# Altium project stm32h743.PrjPcb
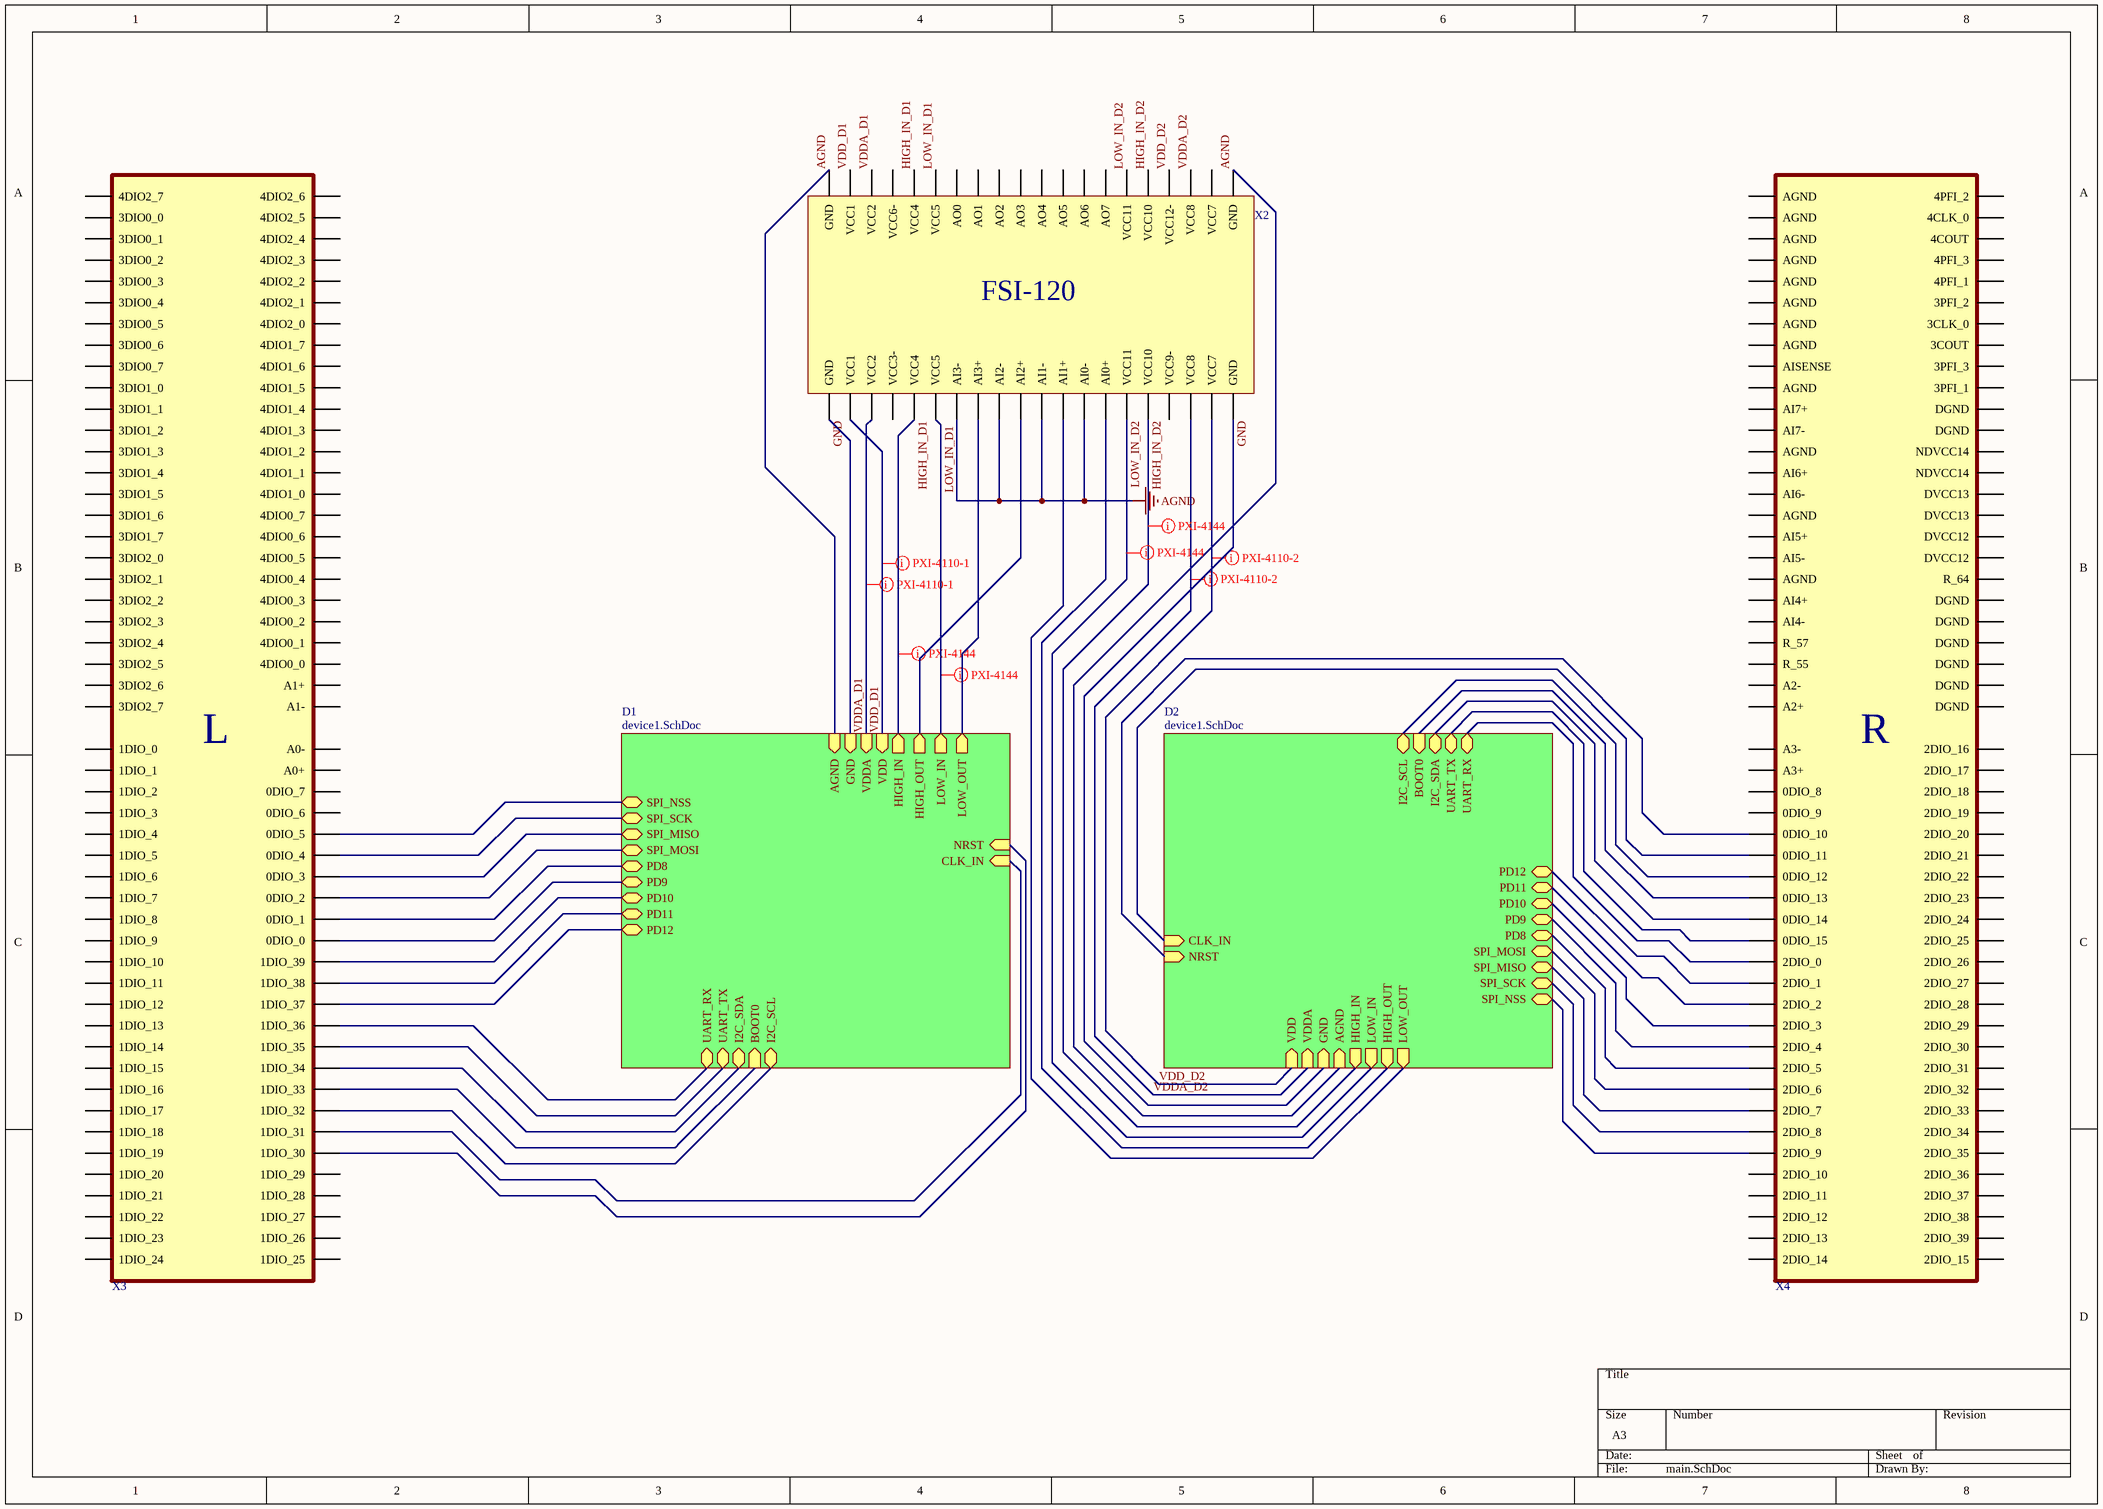
[diagram p0: main.SchDoc]
2 sheets, 37 parts. Net scope: hierarchical (ports join the sheet entries above them; power ports are global).
Board file: board.PcbDoc
Sheets:
  main.SchDoc
    D1 = device1.SchDoc
    D2 = device1.SchDoc

## Sheet main.SchDoc
size A3

### Parts
(Parts that share a designator on the sheet are numbered #1, #2 ... from top to bottom, then left to right.)
X2#1  FSI120  [FSI-120]  (value not drawn)
X3  FSI-150-L  [FSI-150]  (value not drawn)
X4  FSI-150-R  [FSI-150]  (value not drawn)

### Sub-sheets
D1 = device1.SchDoc: AGND (in), GND (in), VDDA (in), VDD (in), SPI_NSS (bidir), SPI_SCK (bidir), SPI_MISO (bidir), SPI_MOSI (bidir), PD8 (bidir), PD9 (bidir), PD10 (bidir), PD11 (bidir), PD12 (bidir), UART_RX (bidir), UART_TX (bidir), I2C_SDA (bidir), BOOT0 (in), I2C_SCL (bidir), HIGH_IN (out), LOW_IN (out), NRST (in), CLK_IN (in), HIGH_OUT (out), LOW_OUT (out)
D2 = device1.SchDoc: AGND (in), GND (in), VDDA (in), VDD (in), SPI_NSS (bidir), SPI_SCK (bidir), SPI_MISO (bidir), SPI_MOSI (bidir), PD8 (bidir), PD9 (bidir), PD10 (bidir), PD11 (bidir), PD12 (bidir), UART_RX (bidir), UART_TX (bidir), I2C_SDA (bidir), BOOT0 (in), I2C_SCL (bidir), HIGH_IN (out), LOW_IN (out), NRST (in), CLK_IN (in), LOW_OUT (out), HIGH_OUT (out)

### Nets
AGND: X2#1.8(AI0-) X2#1.10(AI1-) X2#1.12(AI2-) X2#1.14(AI3-) X2#1.21(GND) X2#1.40(GND) ; sheet D1/AGND, sheet D2/AGND
GND: X2#1.1(GND) X2#1.20(GND) ; sheet D1/GND, sheet D2/GND
VDD_D1: X2#1.2(VCC7) X2#1.19(VCC1) X2#1.22(VCC1) X2#1.39(VCC12-) ; sheet D1/VDD, sheet D2/VDD  [also labelled VDD_D2]  [project net VDD]
BOOT0: X3.R_18(1DIO_33) ; sheet D1/BOOT0
BOOT0: X4.R_35(0DIO_13) ; sheet D2/BOOT0  [a separate net that carries the same name]
CLK_IN: X3.R_14(1DIO_31) ; sheet D1/CLK_IN
CLK_IN: X4.R_39(0DIO_11) ; sheet D2/CLK_IN  [a separate net that carries the same name]
HIGH_IN_D1: X2#1.16(VCC4) X2#1.25(VCC4) ; sheet D1/HIGH_IN  [project net HIGH_IN]
HIGH_IN_D2: X2#1.5(VCC10) X2#1.36(VCC10) ; sheet D2/HIGH_IN  [project net HIGH_IN]
HIGH_OUT: X2#1.7(AI0+) ; sheet D2/HIGH_OUT
HIGH_OUT: X2#1.11(AI2+) ; sheet D1/HIGH_OUT  [a separate net that carries the same name]
I2C_SCL: X3.R_16(1DIO_32) ; sheet D1/I2C_SCL
I2C_SCL: X4.R_37(0DIO_12) ; sheet D2/I2C_SCL  [a separate net that carries the same name]
I2C_SDA: X3.R_20(1DIO_34) ; sheet D1/I2C_SDA
I2C_SDA: X4.R_33(0DIO_14) ; sheet D2/I2C_SDA  [a separate net that carries the same name]
LOW_IN_D1: X2#1.15(VCC5) X2#1.26(VCC5) ; sheet D1/LOW_IN  [project net LOW_IN]
LOW_IN_D2: X2#1.6(VCC11) X2#1.35(VCC11) ; sheet D2/LOW_IN  [project net LOW_IN]
LOW_OUT: X2#1.9(AI1+) ; sheet D2/LOW_OUT
LOW_OUT: X2#1.13(AI3+) ; sheet D1/LOW_OUT  [a separate net that carries the same name]
NRST: X3.R_12(1DIO_30) ; sheet D1/NRST
NRST: X4.R_41(0DIO_10) ; sheet D2/NRST  [a separate net that carries the same name]
PD8: X3.R_34(0DIO_1) ; sheet D1/PD8
PD8: X4.R_19(2DIO_5) ; sheet D2/PD8  [a separate net that carries the same name]
PD9: X3.R_32(0DIO_0) ; sheet D1/PD9
PD9: X4.R_21(2DIO_4) ; sheet D2/PD9  [a separate net that carries the same name]
PD10: X3.R_30(1DIO_39) ; sheet D1/PD10
PD10: X4.R_23(2DIO_3) ; sheet D2/PD10  [a separate net that carries the same name]
PD11: X3.R_28(1DIO_38) ; sheet D1/PD11
PD11: X4.R_25(2DIO_2) ; sheet D2/PD11  [a separate net that carries the same name]
PD12: X3.R_26(1DIO_37) ; sheet D1/PD12
PD12: X4.R_27(2DIO_1) ; sheet D2/PD12  [a separate net that carries the same name]
SPI_MISO: X3.R_38(0DIO_3) ; sheet D1/SPI_MISO
SPI_MISO: X4.R_15(2DIO_7) ; sheet D2/SPI_MISO  [a separate net that carries the same name]
SPI_MOSI: X3.R_36(0DIO_2) ; sheet D1/SPI_MOSI
SPI_MOSI: X4.R_17(2DIO_6) ; sheet D2/SPI_MOSI  [a separate net that carries the same name]
SPI_NSS: X3.R_42(0DIO_5) ; sheet D1/SPI_NSS
SPI_NSS: X4.R_11(2DIO_9) ; sheet D2/SPI_NSS  [a separate net that carries the same name]
SPI_SCK: X3.R_40(0DIO_4) ; sheet D1/SPI_SCK
SPI_SCK: X4.R_13(2DIO_8) ; sheet D2/SPI_SCK  [a separate net that carries the same name]
UART_RX: X3.R_24(1DIO_36) ; sheet D1/UART_RX
UART_RX: X4.R_29(2DIO_0) ; sheet D2/UART_RX  [a separate net that carries the same name]
UART_TX: X3.R_22(1DIO_35) ; sheet D1/UART_TX
UART_TX: X4.R_31(0DIO_15) ; sheet D2/UART_TX  [a separate net that carries the same name]
VDDA_D1: X2#1.18(VCC2) X2#1.23(VCC2) ; sheet D1/VDDA  [project net VDDA]
VDDA_D2: X2#1.3(VCC8) X2#1.38(VCC8) ; sheet D2/VDDA  [project net VDDA]

Not connected (* = marked no-connect by the designer): X2#1 4(VCC9-) 17(VCC3-) 24(VCC6-) 27(AO0) 28(AO1) 29(AO2) 30(AO3) 31(AO4) 32(AO5) 33(AO6) 34(AO7) 37(VCC7); X3 R_1(1DIO_24) R_2(1DIO_25) R_3(1DIO_23) R_4(1DIO_26) R_5(1DIO_22) R_6(1DIO_27) R_7(1DIO_21) R_8(1DIO_28) R_9(1DIO_20) R_10(1DIO_29) R_11(1DIO_19) R_13(1DIO_18) R_15(1DIO_17) R_17(1DIO_16) R_19(1DIO_15) R_21(1DIO_14) R_23(1DIO_13) R_25(1DIO_12) R_27(1DIO_11) R_29(1DIO_10) R_31(1DIO_9) R_33(1DIO_8) R_35(1DIO_7) R_37(1DIO_6) R_39(1DIO_5) R_41(1DIO_4) R_43(1DIO_3) R_44(0DIO_6) R_45(1DIO_2) R_46(0DIO_7) R_47(1DIO_1) R_48(A0+) R_49(1DIO_0) R_50(A0-) R_51(3DIO2_7) R_52(A1-) R_53(3DIO2_6) R_54(A1+) R_55(3DIO2_5) R_56(4DIO0_0) R_57(3DIO2_4) R_58(4DIO0_1) R_59(3DIO2_3) R_60(4DIO0_2) R_61(3DIO2_2) R_62(4DIO0_3) R_63(3DIO2_1) R_64(4DIO0_4) R_65(3DIO2_0) R_66(4DIO0_5) R_67(3DIO1_7) R_68(4DIO0_6) R_69(3DIO1_6) R_70(4DIO0_7) R_71(3DIO1_5) R_72(4DIO1_0) R_73(3DIO1_4) R_74(4DIO1_1) R_75(3DIO1_3) R_76(4DIO1_2) R_77(3DIO1_2) R_78(4DIO1_3) R_79(3DIO1_1) R_80(4DIO1_4) R_81(3DIO1_0) R_82(4DIO1_5) R_83(3DIO0_7) R_84(4DIO1_6) R_85(3DIO0_6) R_86(4DIO1_7) R_87(3DIO0_5) R_88(4DIO2_0) R_89(3DIO0_4) R_90(4DIO2_1) R_91(3DIO0_3) R_92(4DIO2_2) R_93(3DIO0_2) R_94(4DIO2_3) R_95(3DIO0_1) R_96(4DIO2_4) R_97(3DIO0_0) R_98(4DIO2_5) R_99(4DIO2_7) R_100(4DIO2_6); X4 R_1(2DIO_14) R_2(2DIO_15) R_3(2DIO_13) R_4(2DIO_39) R_5(2DIO_12) R_6(2DIO_38) R_7(2DIO_11) R_8(2DIO_37) R_9(2DIO_10) R_10(2DIO_36) R_12(2DIO_35) R_14(2DIO_34) R_16(2DIO_33) R_18(2DIO_32) R_20(2DIO_31) R_22(2DIO_30) R_24(2DIO_29) R_26(2DIO_28) R_28(2DIO_27) R_30(2DIO_26) R_32(2DIO_25) R_34(2DIO_24) R_36(2DIO_23) R_38(2DIO_22) R_40(2DIO_21) R_42(2DIO_20) R_43(0DIO_9) R_44(2DIO_19) R_45(0DIO_8) R_46(2DIO_18) R_47(A3+) R_48(2DIO_17) R_49(A3-) R_50(2DIO_16) R_51(A2+) R_52(DGND) R_53(A2-) R_54(DGND) R_55 R_56(DGND) R_57 R_58(DGND) R_59(AI4-) R_60(DGND) R_61(AI4+) R_62(DGND) R_63(AGND) R_64 R_65(AI5-) R_66(DVCC12) R_67(AI5+) R_68(DVCC12) R_69(AGND) R_70(DVCC13) R_71(AI6-) R_72(DVCC13) R_73(AI6+) R_74(NDVCC14) R_75(AGND) R_76(NDVCC14) R_77(AI7-) R_78(DGND) R_79(AI7+) R_80(DGND) R_81(AGND) R_82(3PFI_1) R_83(AISENSE) R_84(3PFI_3) R_85(AGND) R_86(3COUT) R_87(AGND) R_88(3CLK_0) R_89(AGND) R_90(3PFI_2) R_91(AGND) R_92(4PFI_1) R_93(AGND) R_94(4PFI_3) R_95(AGND) R_96(4COUT) R_97(AGND) R_98(4CLK_0) R_99(AGND) R_100(4PFI_2)

### Layout directives
mark named PXI-4110-1: VDD, VDDA
mark named PXI-4110-2: VDD, VDDA
mark named PXI-4144: HIGH_IN, LOW_IN

### Notes on the sheet
- (in symbol FSI120) FSI-120
- (in symbol FSI-150-L) L
- (in symbol FSI-150-R) R

### Library data of the parts
X3 = FSI-150-L: fsi 150 left
X4 = FSI-150-R: fsi 150 right

## Sheet device1.SchDoc
size A3
Used 2 times, as channels D1, D2. Parts and nets are listed once, with the designators drawn on the sheet.
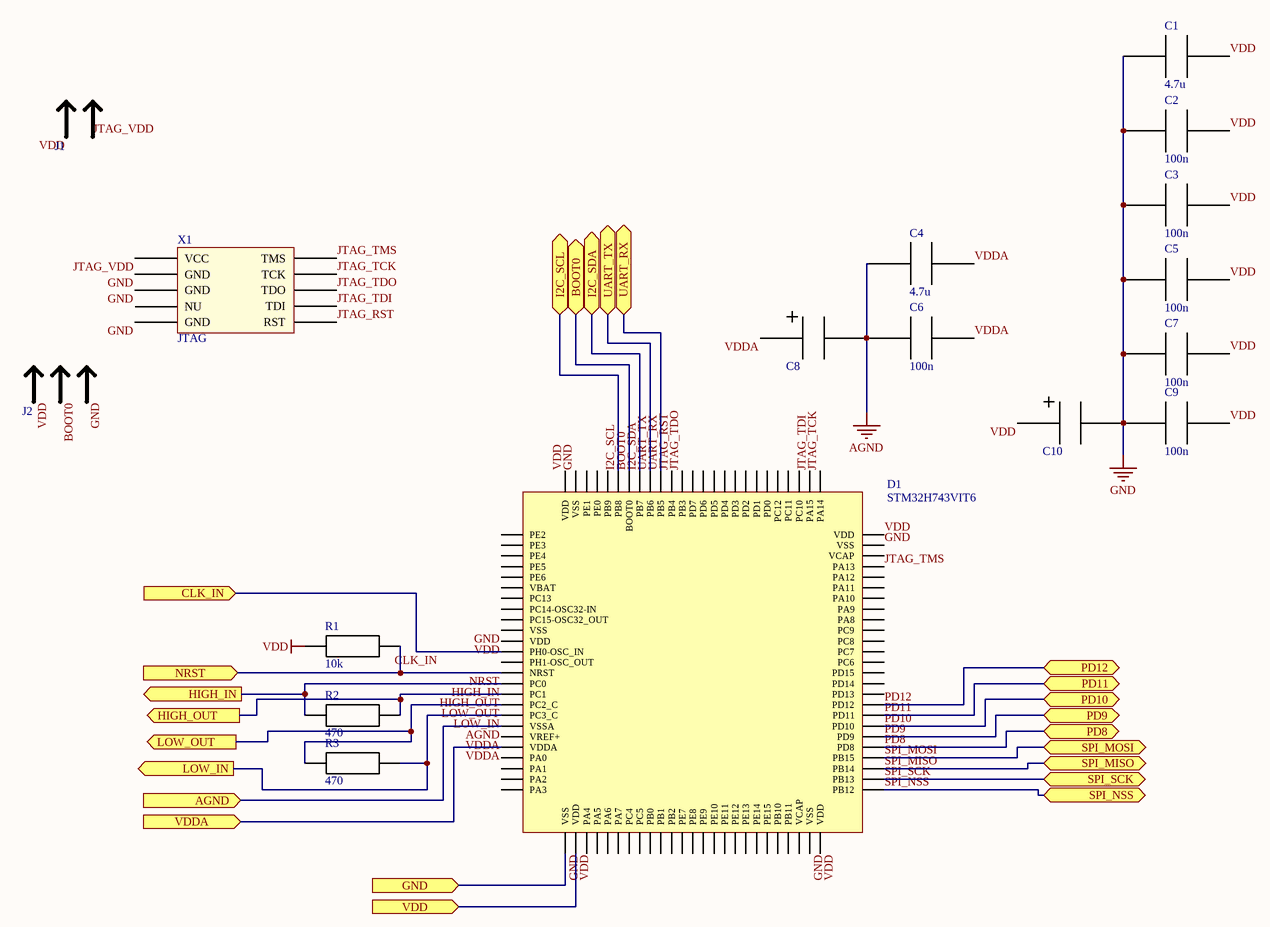
[diagram p1: device1.SchDoc]

### Parts
C1  4.7u  [0805]
C2  100n  [0805]
C3  100n  [0805]
C4  4.7u  [0805]
C5  100n  [0805]
C6  100n  [0805]
C7  100n  [0805]
C8  C_Ta  [C_Ta]  (value not drawn)
C9  100n  [0805]
C10  C_Ta  [C_Ta]  (value not drawn)
D1  STM32H743VIT6  [STM32H743VIT6]
J1  jumper switch  [JUMPER_SWITCH]  (value not drawn)
J2  JUMPER_SWITCH_2S  [JUMPER_SWITCH_2S]  (value not drawn)
R1  10k  [0805]
R2  470  [0805]
R3  470  [0805]
X1  JTAG  [JTAG_PLD]

### Ports
AGND (in), BOOT0 (bidir), CLK_IN (in), GND (in), HIGH_IN (out), HIGH_OUT (out), I2C_SCL (bidir), I2C_SDA (bidir), LOW_IN (out), LOW_OUT (out), NRST (in), PD8 (bidir), PD9 (bidir), PD10 (bidir), PD11 (bidir), PD12 (bidir), SPI_MISO (bidir), SPI_MOSI (bidir), SPI_NSS (bidir), SPI_SCK (bidir), UART_RX (bidir), UART_TX (bidir), VDD (in), VDDA (in)

### Nets
AGND: C4.1 C6.1 C8.2 D1.19(VSSA) ; port AGND
GND: C1.1 C2.1 C3.1 C5.1 C7.1 C9.1 C10.2 D1.10(VSS) D1.26(VSS) D1.49(VSS) D1.74(VSS) D1.99(VSS) J2.2 X1.3(GND) X1.5(GND) X1.9(GND) ; port GND
VDD: C1.2 C2.2 C3.2 C5.2 C7.2 C9.2 C10.1 D1.11(VDD) D1.27(VDD) D1.50(VDD) D1.75(VDD) D1.100(VDD) J1.0 J2.1 R1.1 ; port VDD
BOOT0: D1.94(BOOT0) J2.0 ; port BOOT0
CLK_IN: D1.12(PH0-OSC_IN) ; port CLK_IN
HIGH_IN: D1.15(PC0) R2.1 ; port HIGH_IN
HIGH_OUT: D1.16(PC1) R2.2 ; port HIGH_OUT
I2C_SCL: D1.95(PB8) ; port I2C_SCL
I2C_SDA: D1.93(PB7) ; port I2C_SDA
JTAG_RST: D1.90(PB4) X1.10(RST)
JTAG_TCK: D1.76(PA14) X1.4(TCK)
JTAG_TDI: D1.77(PA15) X1.8(TDI)
JTAG_TDO: D1.89(PB3) X1.6(TDO)
JTAG_TMS: D1.72(PA13) X1.2(TMS)
JTAG_VDD: J1.1 X1.1(VCC)
LOW_IN: D1.18(PC3_C) R3.1 ; port LOW_IN
LOW_OUT: D1.17(PC2_C) R3.2 ; port LOW_OUT
NRST: D1.14(NRST) R1.2 ; port NRST
PD8: D1.55(PD8) ; port PD8
PD9: D1.56(PD9) ; port PD9
PD10: D1.57(PD10) ; port PD10
PD11: D1.58(PD11) ; port PD11
PD12: D1.59(PD12) ; port PD12
SPI_MISO: D1.53(PB14) ; port SPI_MISO
SPI_MOSI: D1.54(PB15) ; port SPI_MOSI
SPI_NSS: D1.51(PB12) ; port SPI_NSS
SPI_SCK: D1.52(PB13) ; port SPI_SCK
UART_RX: D1.91(PB5) ; port UART_RX
UART_TX: D1.92(PB6) ; port UART_TX
VDDA: C4.2 C6.2 C8.1 D1.20(VREF+) D1.21(VDDA) ; port VDDA

Not connected (* = marked no-connect by the designer): D1 1(PE2) 2(PE3) 3(PE4) 4(PE5) 5(PE6) 6(VBAT) 7(PC13) 8(PC14-OSC32-IN) 9(PC15-OSC32_OUT) 13(PH1-OSC_OUT) 22(PA0) 23(PA1) 24(PA2) 25(PA3) 28(PA4) 29(PA5) 30(PA6) 31(PA7) 32(PC4) 33(PC5) 34(PB0) 35(PB1) 36(PB2) 37(PE7) 38(PE8) 39(PE9) 40(PE10) 41(PE11) 42(PE12) 43(PE13) 44(PE14) 45(PE15) 46(PB10) 47(PB11) 48(VCAP) 60(PD13) 61(PD14) 62(PD15) 63(PC6) 64(PC7) 65(PC8) 66(PC9) 67(PA8) 68(PA9) 69(PA10) 70(PA11) 71(PA12) 73(VCAP) 78(PC10) 79(PC11) 80(PC12) 81(PD0) 82(PD1) 83(PD2) 84(PD3) 85(PD4) 86(PD5) 87(PD6) 88(PD7) 96(PB9) 97(PE0) 98(PE1); X1 7(NU)

### Channels
D1: designators C1=C1 C2=C2 C3=C3 C4=C4 C5=C5 C6=C7 C7=C8 C8=C6 C9=C10 C10=C9 D1=D1 J1=J1 J2=J2 R1=R1 R2=R2 R3=R3 X1=X1; ports AGND=AGND BOOT0=BOOT0 CLK_IN=CLK_IN GND=GND HIGH_IN=HIGH_IN HIGH_OUT=HIGH_OUT I2C_SCL=I2C_SCL I2C_SDA=I2C_SDA LOW_IN=LOW_IN LOW_OUT=LOW_OUT NRST=NRST PD8=PD8 PD9=PD9 PD10=PD10 PD11=PD11 PD12=PD12 SPI_MISO=SPI_MISO SPI_MOSI=SPI_MOSI SPI_NSS=SPI_NSS SPI_SCK=SPI_SCK UART_RX=UART_RX UART_TX=UART_TX VDD=VDD VDDA=VDDA
D2: designators C1=C11 C2=C12 C3=C13 C4=C14 C5=C15 C6=C17 C7=C18 C8=C16 C9=C20 C10=C19 D1=D2 J1=J3 J2=J4 R1=R4 R2=R5 R3=R6 X1=X2#2; ports AGND=AGND BOOT0=BOOT0 CLK_IN=CLK_IN GND=GND HIGH_IN=HIGH_IN HIGH_OUT=HIGH_OUT I2C_SCL=I2C_SCL I2C_SDA=I2C_SDA LOW_IN=LOW_IN LOW_OUT=LOW_OUT NRST=NRST PD8=PD8 PD9=PD9 PD10=PD10 PD11=PD11 PD12=PD12 SPI_MISO=SPI_MISO SPI_MOSI=SPI_MOSI SPI_NSS=SPI_NSS SPI_SCK=SPI_SCK UART_RX=UART_RX UART_TX=UART_TX VDD=VDD VDDA=VDDA

### Library data of the parts
C1-C7 C9 = C0805: 0805 ceramic capacitor
  C1 C4: Capacity: 4.7u
  C2 C3 C5-C7 C9: Capacity: 100n
C8 C10 = C_Ta: tantalum capacitor
D1 = STM32H743VIT6: 32-bit cortex m7 uc
J1 = JUMPER_SWITCH
J2 = JUMPER_SWITCH_2S: 2 state jumper switch
R1-R3 = R0805: 0805 resistor
  R1: Resistance: 10k
  R2 R3: Resistance: 470
X1 = JTAG: jtag pld

## Nets that join several sheets
AGND: main (6 pins), D1 (C4.1 C6.2 C7.1 D1.19), D2 (C14.1 C16.2 C17.1 D2.19)
GND: main (X2#1.1 X2#1.20), D1 (16 pins), D2 (16 pins)
VDD: main (X2#1.2 X2#1.19 X2#1.22 X2#1.39), D1 (15 pins), D2 (15 pins)
BOOT0: main (X3.R_18), D1 (D1.94 J2.0)
BOOT0: main (X4.R_35), D2 (D2.94 J4.0)
CLK_IN: main (X3.R_14), D1 (D1.12)
CLK_IN: main (X4.R_39), D2 (D2.12)
HIGH_IN: main (X2#1.5 X2#1.36), D2 (D2.15 R5.1)
HIGH_IN: main (X2#1.16 X2#1.25), D1 (D1.15 R2.1)
HIGH_OUT: main (X2#1.7), D2 (D2.16 R5.2)
HIGH_OUT: main (X2#1.11), D1 (D1.16 R2.2)
I2C_SCL: main (X3.R_16), D1 (D1.95)
I2C_SCL: main (X4.R_37), D2 (D2.95)
I2C_SDA: main (X3.R_20), D1 (D1.93)
I2C_SDA: main (X4.R_33), D2 (D2.93)
LOW_IN: main (X2#1.6 X2#1.35), D2 (D2.18 R6.1)
LOW_IN: main (X2#1.15 X2#1.26), D1 (D1.18 R3.1)
LOW_OUT: main (X2#1.9), D2 (D2.17 R6.2)
LOW_OUT: main (X2#1.13), D1 (D1.17 R3.2)
NRST: main (X3.R_12), D1 (D1.14 R1.2)
NRST: main (X4.R_41), D2 (D2.14 R4.2)
PD8: main (X3.R_34), D1 (D1.55)
PD8: main (X4.R_19), D2 (D2.55)
PD9: main (X3.R_32), D1 (D1.56)
PD9: main (X4.R_21), D2 (D2.56)
PD10: main (X3.R_30), D1 (D1.57)
PD10: main (X4.R_23), D2 (D2.57)
PD11: main (X3.R_28), D1 (D1.58)
PD11: main (X4.R_25), D2 (D2.58)
PD12: main (X3.R_26), D1 (D1.59)
PD12: main (X4.R_27), D2 (D2.59)
SPI_MISO: main (X3.R_38), D1 (D1.53)
SPI_MISO: main (X4.R_15), D2 (D2.53)
SPI_MOSI: main (X3.R_36), D1 (D1.54)
SPI_MOSI: main (X4.R_17), D2 (D2.54)
SPI_NSS: main (X3.R_42), D1 (D1.51)
SPI_NSS: main (X4.R_11), D2 (D2.51)
SPI_SCK: main (X3.R_40), D1 (D1.52)
SPI_SCK: main (X4.R_13), D2 (D2.52)
UART_RX: main (X3.R_24), D1 (D1.91)
UART_RX: main (X4.R_29), D2 (D2.91)
UART_TX: main (X3.R_22), D1 (D1.92)
UART_TX: main (X4.R_31), D2 (D2.92)
VDDA: main (X2#1.3 X2#1.38), D2 (5 pins)
VDDA: main (X2#1.18 X2#1.23), D1 (5 pins)